# Altium schematic sheet Power.SchDoc: POWER
size 420 x 297 mm; Date: UNUSED; Author: RTU; CompanyName: CMT; DrawnBy: UNUSED; Engineer: UNUSED; Organization: Curtin Motorsport Team; Address1: Rm 151 Building 206; Address2: Curtin University; Address3: Kent Street, Bentley; Address4: Western Australia; DocumentNumber: UNUSED; Revision: UNUSED; SheetNumber: 2; SheetTotal: 5; Year: UNUSED; SheetSize: A3; Time: UNUSED; ImagePath: UNUSED; Application_BuildNumber: UNUSED
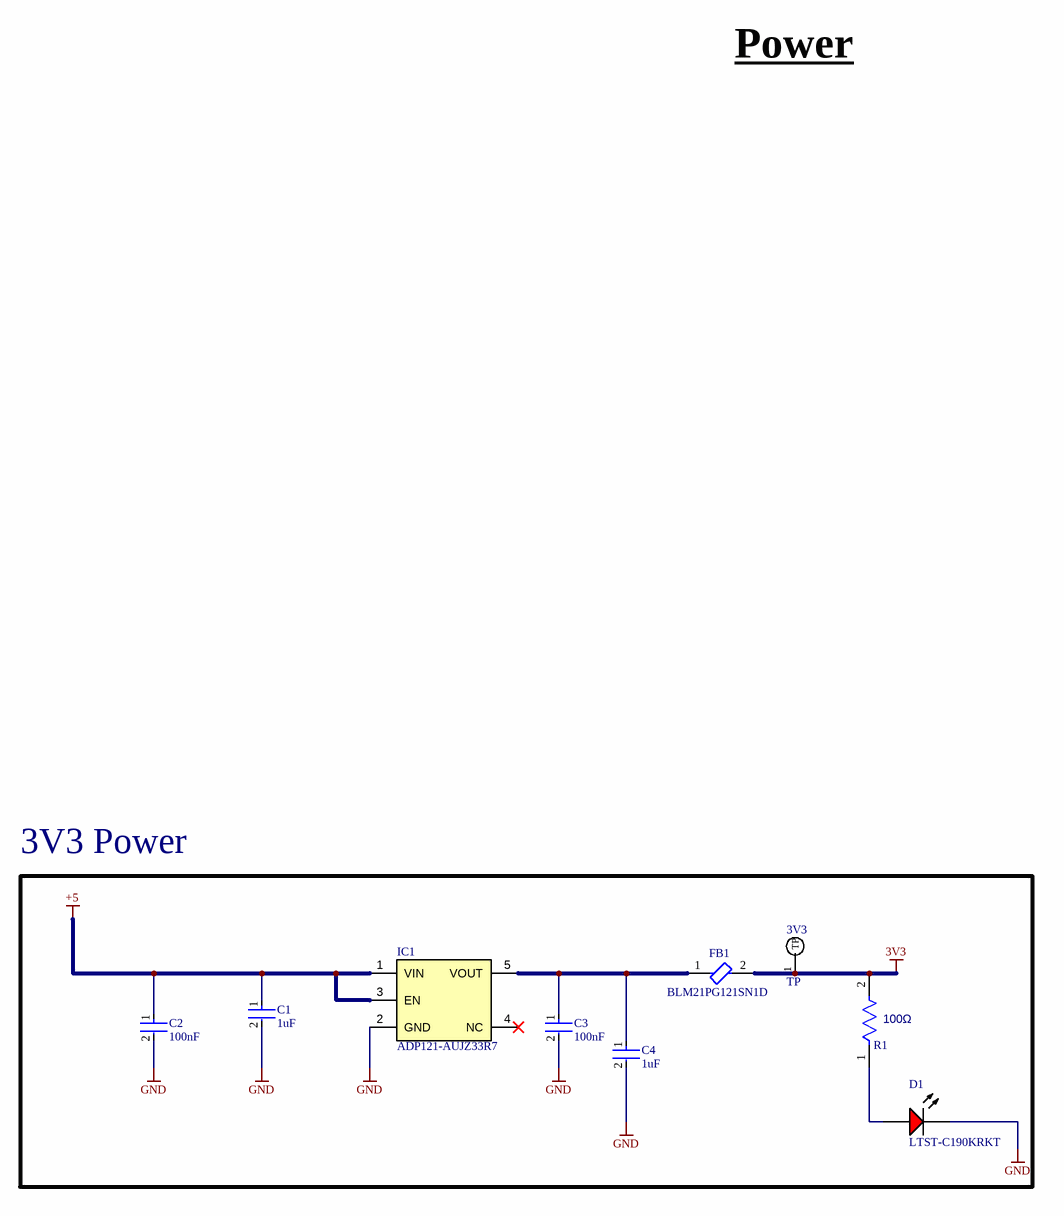
[diagram p0: Power.SchDoc]

## Parts
3V3  TP  [TestPad]
C1  1uF  [FP-CC0603-DA-MFG]
C2  100nF  [FP-GRM188-0_1-e0_2_0_55-IPC_A]
C3  100nF  [FP-GRM188-0_1-e0_2_0_55-IPC_A]
C4  1uF  [FP-CC0603-DA-MFG]
D1  LTST-C190KRKT  [LTST-C191KRKT_V]
FB1  BLM21PG121SN1D  [FP-BLM21-0_2-t0_85-e0_5-d-IPC_B]
IC1  ADP121-AUJZ33R7  [SOT95P280X100-5N]
R1  Resistance: 100Ω  [FP-RC0603-0_55-IPC_A]  (hidden comment: RC0603FR-07100RL)

## Blocks framed on the sheet
3V3 Power: 3V3 C1-C4 D1 FB1 IC1 R1

## Nets
3V3: 3V3.1(TP) FB1.2 R1.2
+5: C1.1 C2.1 IC1.1(VIN) IC1.3(EN)
GND: C1.2 C2.2 C3.2 C4.2 D1.2(K) IC1.2(GND)
NetC3_1: C3.1 C4.1 FB1.1 IC1.5(VOUT)
NetD1_1: D1.1(A) R1.1

Not connected (* = marked no-connect by the designer): IC1 4(NC)*

## Notes on the sheet
- Power
- Project:
- Title:
- Project Number:
- Size:
- Status:
- Revision:
- Year:
- Design Date:
- Author:
- Latest Revision Date:
- Sheet
- Checked:
- Checked
- of
- Date:

## Library data of the parts
3V3 = Test Points
C1 C4 = CMP-03422-000924-1: CAP CER 1UF 16V X7R 0603; Manufacturer: YAGEO; Manufacturer Part Number: CC0603KRX7R7BB105; Tolerance: 0.1; Temperature Coefficient: 15%; Material: Ceramic; Package: CC0603-DA; RoHS: TRUE; Device Class L2: Capacitors; Temperature Characteristic: X7R; Temperature: -55°C to +125°C; Temperature Range Low: -55°C; Automotive: No; ComponentLink2Description: Datasheet; Value: 1 uF; Lead Free: Yes; Capacitance: 1 uF; ComponentLink2URL: http://www.yageo.com/documents/recent/UPY-GPHC_X7R_6.3V-to-50V_18.pdf; Device Class L1: Passive Components; Voltage: 16 V; Octopart: https://octopart.com/cc0603krx7r7bb105-yageo-42271928; Category: Cap; Digikey Description: CAP CER 1UF 16V X7R 0603; Footprint Url: http://www.yageo.com/exep/pages/download/literatures/UPY-C_GEN_24.pdf; Height: 0.9mm; Voltage Rating: 16 V; Temperature Range High: +125°C; Mouser Description: Multilayer Ceramic Capacitor, CC Series, 1 - F, - 10%, X7R, 16 V, 0603 [1608 Metric]; Device Class L3: Ceramic Capacitors
C2 C3 = CMP-2006-02792-2: Chip Multilayer Ceramic Capacitors for General Purpose, 0603, 10uF, X5R, 15%, 20%, 6.3V; Packaging: Tape and Reel; Voltage Rating (DC): 6.3V; Width: 0.031inch; Termination: SMD/SMT; Dielectric: X5R; Package Quantity: 4000; Voltage Rating: 6.3V; Capacitance: 10uF; Case/Package: 0603; Min Operating Temperature: -55°C; Voltage: 6.3V; Length: 1.6mm; Thickness: 0.035inch; Lead Free: Lead Free; Depth: 0.8mm; Case Code (Imperial): 0603; Max Operating Temperature: 85°C; Material: Ceramic; Height: 0.8mm; Tolerance: 20%; Mount: Surface Mount; REACH SVHC: No SVHC; Radiation Hardening: No; Case Code (Metric): 1608
D1 = CMP-007-00024-3: LED Uni-Color Red, 62.5 mW, 25 mA, -30 to 85 degC, 2-Pin SMD, RoHS, Tape and Reel; Manufacturer: Lite-On; Manufacturer_Name: Vishay; Power: 75mW; Forward Voltage: 2V; Luminous Intensity: 54mcd; Lens Style: Diffused; Viewing Angle: 130degrees; Forward Current: 20mA; Manufacturer URL: http://www.us.liteon.com/; Case/Package: 0603; Datasheet Version: Rev. F, 05/2013; Package Reference: C191KRKT; Datasheet URL: http://optoelectronics.liteon.com/upload/download/DS-22-99-0151/S_110_LTST-C190KRKT.pdf; Package Description: 2-Pin Surface Mount Device, Body 1.6 x 0.8 mm; Nominal Vf: 2V; Packaging: TapeandReel; RoHS Compliant: True; Pins: 2; Illumination Colour: Red; Colour: Red; Mounting Technology: SM; Package Quantity: 3000; Min Operating Temperature: -55°C; Max Operating Temperature: 85°C; Manufacturer_Part_Number: LTST-C190KRKT
FB1 = CMP-00002-2: Ferrite Beads Multi-Layer 120Ohm 25% 100MHz 3A 30mOhm DCR 0805 Paper T/R; Manufacturer_Name: Murata; Material: Steel,Ferrite; DC Resistance (DCR): 30mR; Impedance: 120R; Case/Package: 0805; Case Code (Imperial): 0805; Min Operating Temperature: -55°C; Max Operating Temperature: 125°C; Current Rating: 3A; Manufacturer_Part_Number: BLM21PG121SN1D
IC1 = CMP-009-000019-2: Integrated Circuit; Manufacturer_Name: Analog Devices; Manufacturer_Part_Number: ADP121-AUJZ33R7; Datasheet Link: https://datasheet.lcsc.com/szlcsc/Analog-Devices-ADI-ADP121-AUJZ33R7_C50499.pdf; Source: SamacSys.SchLib; Mouser Price/Stock: https://www.mouser.co.uk/ProductDetail/Analog-Devices/ADP121-AUJZ33R7?qs=BpaRKvA4VqHby1qhPTxfCw%3D%3D; Design Item ID: ADP121-AUJZ33R7; Height: 1mm; Mouser Part Number: 584-ADP121-AUJZ33R7
R1 = CMP-2100-03663-2: NexarPartId: 55402879; Tolerance: 1%; Voltage Rating (DC): 50V; Power Rating: 100mW; Temperature Coefficient: 100ppm/°C; Number of Pins: 2; Height: 450µm; Military Standard: Not; Case Code (Imperial): 0603; Termination: SMD/SMT; Lead Free: Lead Free; Max Operating Temperature: 155°C; Case Code (Metric): 0603; Voltage Rating: 50V; Width: 800µm; Composition: Thick Film; Depth: 800µm; REACH SVHC: Unknown; Min Operating Temperature: -55°C; Packaging: Tape & Reel; Length: 1.6mm; Case/Package: 0603; RoHS: Compliant; Schedule B: 8533210045, 8533210045|8533210045|8533210045|8533210045|8533210045|8533210045|8533210045|8533210045|8533210045|8533210045|8533210045|8533210045|8533210045|8533210045|8533210045|8533210045|8533210045|8533210045|8533210045|8533210045|8533210045|8533210045|8533210045|85